# EAGLE design left (EAGLE 7.6.0)
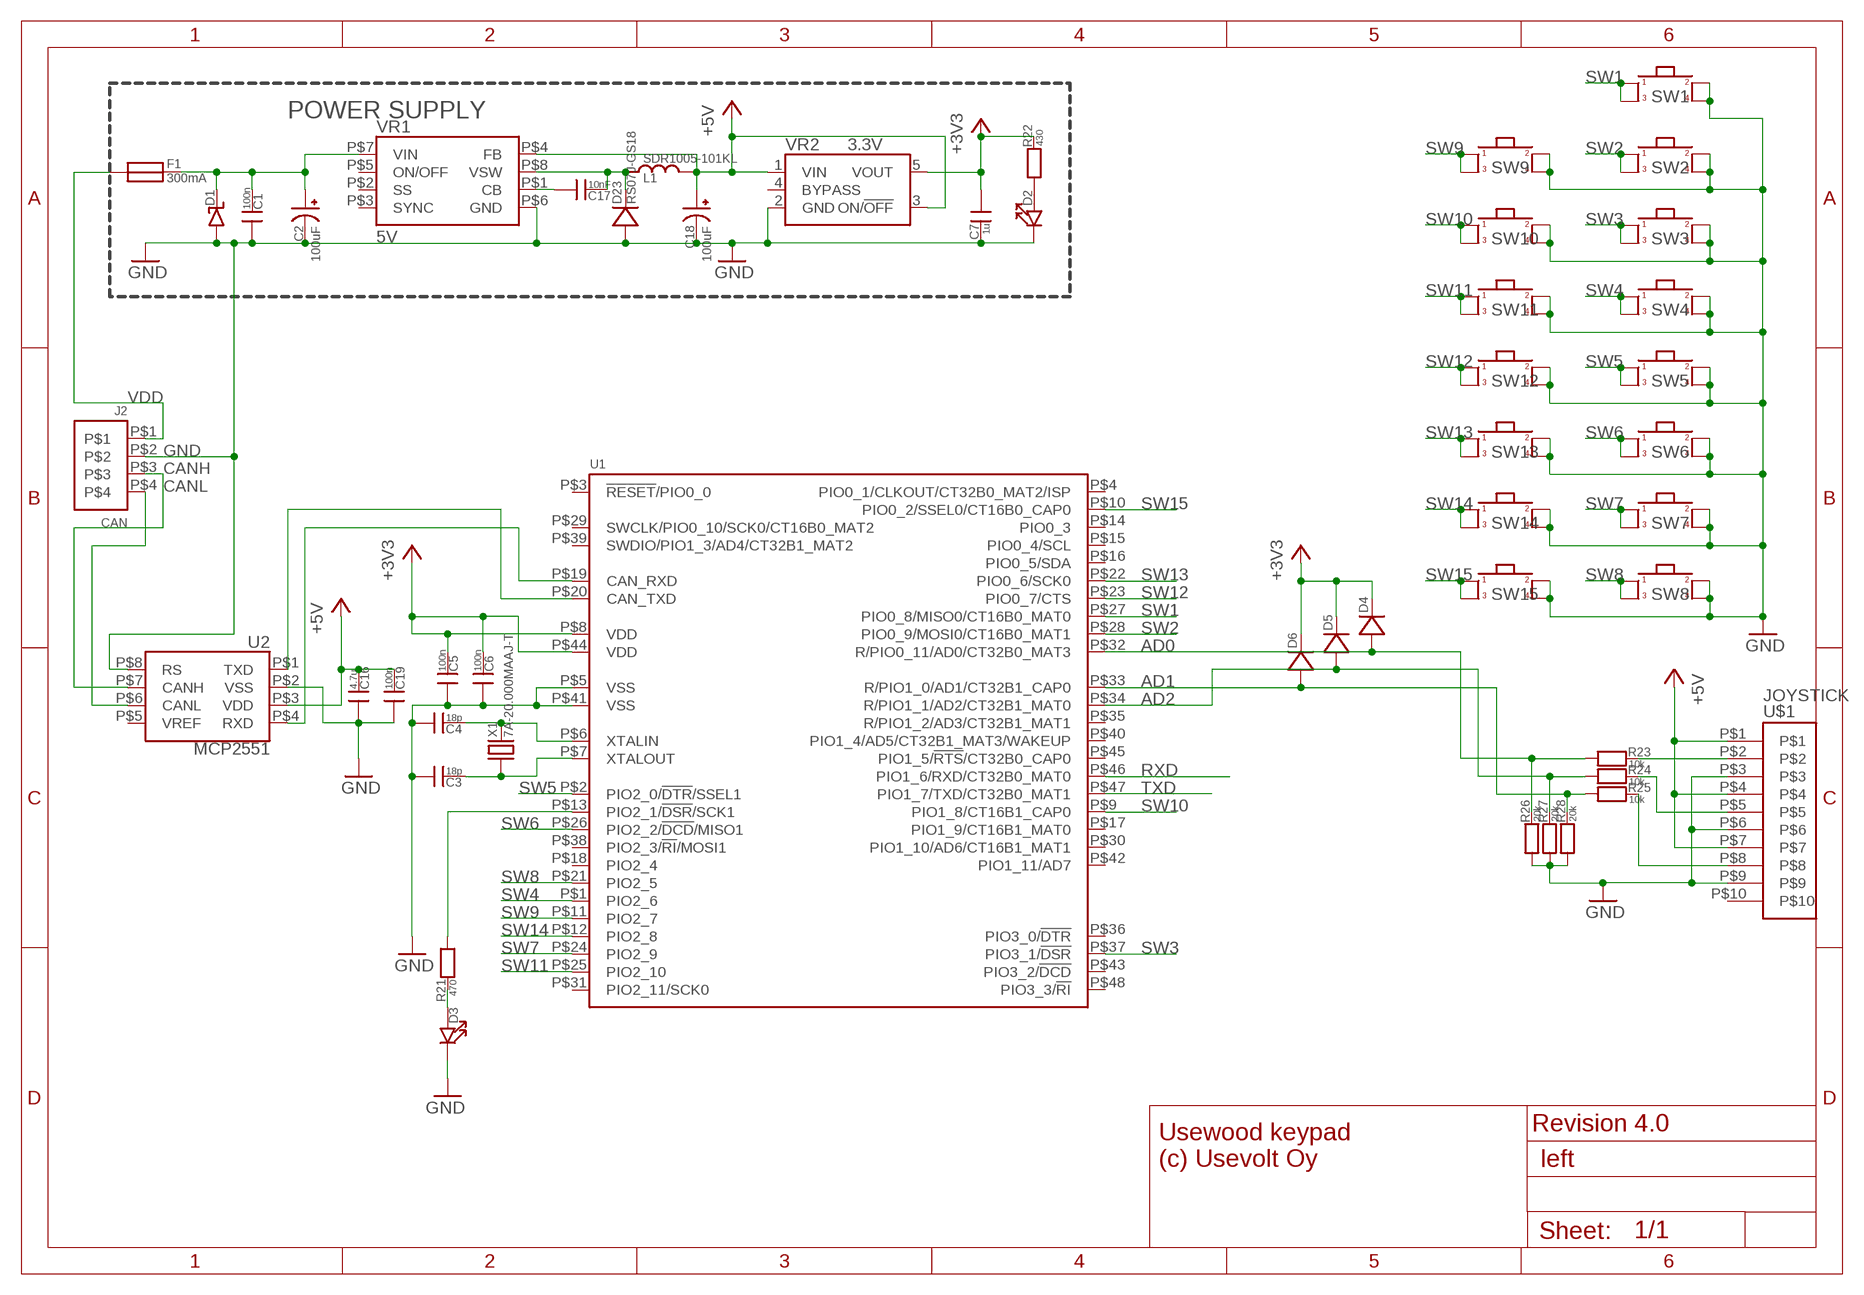
[diagram p0: schematic, sheet 1]

## Parts
C1  100n  CAP_0603  [0603_SILKSCREEN]
C2  100uF  CAP_EEE-FK1H470P  [CAP_POL_8.3X8.3MM]
C3  18p  CAP_0603  [0603_SILKSCREEN]
C4  18p  CAP_0603  [0603_SILKSCREEN]
C5  100n  CAP_0603  [0603_SILKSCREEN]
C6  100n  CAP_0603  [0603_SILKSCREEN]
C7  1u  CAP_0603  [0603_SILKSCREEN]
C16  4.7u  CAP_0603  [0603_SILKSCREEN]
C17  10nF  CAP_0603  [0603_SILKSCREEN]
C18  100uF  CAP_EEE-FK1H470P  [CAP_POL_8.3X8.3MM]
C19  100n  CAP_0603  [0603_SILKSCREEN]
D1  DIODE_TVS_SMBJ33A-TRDO-214AA  [DO-214AA]
D2  LED_0603  [0603_SILKSCREEN]
D3  LED_0603  [0603_SILKSCREEN]
D4  DIODEDO219AB  [DO219AB]
D5  DIODEDO219AB  [DO219AB]
D6  DIODEDO219AB  [DO219AB]
D23  RS07J-GS18  DIODEDO219AB  [DO219AB]
F1  300mA  FUSE_MC36204_100MA  [FUSE_100MA]
J2  CAN  MOLEX_MICRO-FIT_4WAY_SMD  [MOLEX_MICRO_FIT_4WAY_SMD]
L1  SDR1005-101KL  INDUCTORBOURNS_10X13X5MM  [INDUCTOR_BOURNS_10X13X5MM]
R21  470  RES_0603  [0603_SILKSCREEN]
R22  430  RES_0603  [0603_SILKSCREEN]
R23  10k  RES_0603  [0603_SILKSCREEN]
R24  10k  RES_0603  [0603_SILKSCREEN]
R25  10k  RES_0603  [0603_SILKSCREEN]
R26  20k  RES_0603  [0603_SILKSCREEN]
R27  20k  RES_0603  [0603_SILKSCREEN]
R28  20k  RES_0603  [0603_SILKSCREEN]
SW1  SWITCH_KSC421J-70SH-LFS  [SWITCH_KSC421J-70SH-LFS]
SW2  SWITCH_KSC421J-70SH-LFS  [SWITCH_KSC421J-70SH-LFS]
SW3  SWITCH_KSC421J-70SH-LFS  [SWITCH_KSC421J-70SH-LFS]
SW4  SWITCH_KSC421J-70SH-LFS  [SWITCH_KSC421J-70SH-LFS]
SW5  SWITCH_KSC421J-70SH-LFS  [SWITCH_KSC421J-70SH-LFS]
SW6  SWITCH_KSC421J-70SH-LFS  [SWITCH_KSC421J-70SH-LFS]
SW7  SWITCH_KSC421J-70SH-LFS  [SWITCH_KSC421J-70SH-LFS]
SW8  SWITCH_KSC421J-70SH-LFS  [SWITCH_KSC421J-70SH-LFS]
SW9  SWITCH_KSC421J-70SH-LFS  [SWITCH_KSC421J-70SH-LFS]
SW10  SWITCH_KSC421J-70SH-LFS  [SWITCH_KSC421J-70SH-LFS]
SW11  SWITCH_KSC421J-70SH-LFS  [SWITCH_KSC421J-70SH-LFS]
SW12  SWITCH_KSC421J-70SH-LFS  [SWITCH_KSC421J-70SH-LFS]
SW13  SWITCH_KSC421J-70SH-LFS  [SWITCH_KSC421J-70SH-LFS]
SW14  SWITCH_KSC421J-70SH-LFS  [SWITCH_KSC421J-70SH-LFS]
SW15  SWITCH_KSC421J-70SH-LFS  [SWITCH_KSC421J-70SH-LFS]
U1  LPC11C14_QFP48  [QFP48]
U2  MCP2551  MCP2551_SOIC8  [SOIC8]
U$1  JOYSTICK  MOLEX_MICRO-FIT_10WAY_V  [MOLEX_MICRO-FIT_10WAY_V]
VR1  5V  LM2671SOIC8  [SOIC8]
VR2  3.3V  REG_LP2985_SOP5  [SOP5]
X1  7A-20.000MAAJ-T  XTAL_7A-12.000MAAJ-T  [XTAL_SMD_5X3.2]

## Nets
+3V3: C5.1 C6.1 C7.0 D4.P$2(N) D5.P$2(N) D6.P$2(N) R22.1 U1.P$8(VDD) U1.P$44(VDD) VR2.5(VOUT)
+5V: C16.1 C18.P$2(+) C19.1 L1.P$2 U2.P$3(VDD) U$1.P$1 U$1.P$4 U$1.P$7 VR1.P$4(FB) VR2.1(VIN) VR2.3(ON/!OFF)
AD0: D4.P$1(P) R23.0 R26.1 U1.P$32(R/PIO0_11/AD0/CT32B0_MAT3)
AD1: D6.P$1(P) R25.0 R28.1 U1.P$33(R/PIO1_0/AD1/CT32B1_CAP0)
AD2: D5.P$1(P) R24.0 R27.1 U1.P$34(R/PIO1_1/AD2/CT32B1_MAT0)
CANH: J2.P$3 U2.P$7(CANH)
CANL: J2.P$4 U2.P$6(CANL)
GND: C1.0 C2.P$1(-) C3.0 C4.0 C5.0 C6.0 C7.1 C16.0 C18.P$1(-) C19.0 D1.P$1(P) D2.1 D3.1 D23.P$1(P) J2.P$2 R26.0 R27.0 R28.0 SW1.P$3 SW1.P$4 SW2.P$3 SW2.P$4 SW3.P$3 SW3.P$4 SW4.P$3 SW4.P$4 SW5.P$3 SW5.P$4 SW6.P$3 SW6.P$4 SW7.P$3 SW7.P$4 SW8.P$3 SW8.P$4 SW9.P$3 SW9.P$4 SW10.P$3 SW10.P$4 SW11.P$3 SW11.P$4 SW12.P$3 SW12.P$4 SW13.P$3 SW13.P$4 SW14.P$3 SW14.P$4 SW15.P$3 SW15.P$4 U1.P$5(VSS) U1.P$41(VSS) U2.P$2(VSS) U2.P$8(RS) U$1.P$3 U$1.P$6 U$1.P$9 VR1.P$6(GND) VR2.2(GND)
LED3: D3.0 R21.1
N$2: R21.0 U1.P$13(PIO2_1/!DSR!/SCK1)
N$3: D2.0 R22.0
N$4: C1.1 C2.P$2(+) D1.P$2(N) F1.P$2 VR1.P$7(VIN)
N$6: U1.P$20(CAN_TXD) U2.P$1(TXD)
N$11: C17.1 D23.P$2(N) L1.P$1 VR1.P$8(VSW)
N$20: U1.P$19(CAN_RXD) U2.P$4(RXD)
N$32: C17.0 VR1.P$1(CB)
RXD: U1.P$46(PIO1_6/RXD/CT32B0_MAT0)
SW1: SW1.P$1 SW1.P$2 U1.P$27(PIO0_8/MISO0/CT16B0_MAT0)
SW2: SW2.P$1 SW2.P$2 U1.P$28(PIO0_9/MOSI0/CT16B0_MAT1)
SW3: SW3.P$1 SW3.P$2 U1.P$37(PIO3_1/!DSR)
SW4: SW4.P$1 SW4.P$2 U1.P$1(PIO2_6)
SW5: SW5.P$1 SW5.P$2 U1.P$2(PIO2_0/!DTR!/SSEL1)
SW6: SW6.P$1 SW6.P$2 U1.P$26(PIO2_2/!DCD!/MISO1)
SW7: SW7.P$1 SW7.P$2 U1.P$24(PIO2_9)
SW8: SW8.P$1 SW8.P$2 U1.P$21(PIO2_5)
SW9: SW9.P$1 SW9.P$2 U1.P$11(PIO2_7)
SW10: SW10.P$1 SW10.P$2 U1.P$9(PIO1_8/CT16B1_CAP0)
SW11: SW11.P$1 SW11.P$2 U1.P$25(PIO2_10)
SW12: SW12.P$1 SW12.P$2 U1.P$23(PIO0_7/CTS)
SW13: SW13.P$1 SW13.P$2 U1.P$22(PIO0_6/SCK0)
SW14: SW14.P$1 SW14.P$2 U1.P$12(PIO2_8)
SW15: SW15.P$1 SW15.P$2 U1.P$10(PIO0_2/SSEL0/CT16B0_CAP0)
TXD: U1.P$47(PIO1_7/TXD/CT32B0_MAT1)
VDD: F1.P$1 J2.P$1
XJOY: R23.1 U$1.P$2
XTALIN: C4.1 U1.P$6(XTALIN) X1.P$2
XTALOUT: C3.1 U1.P$7(XTALOUT) X1.P$1
YJOY: R24.1 U$1.P$5
ZJOY: R25.1 U$1.P$8
Unconnected: U1.P$3(!RESET!/PIO0_0) U1.P$4(PIO0_1/CLKOUT/CT32B0_MAT2/ISP) U1.P$14(PIO0_3) U1.P$15(PIO0_4/SCL) U1.P$16(PIO0_5/SDA) U1.P$17(PIO1_9/CT16B1_MAT0) U1.P$18(PIO2_4) U1.P$29(SWCLK/PIO0_10/SCK0/CT16B0_MAT2) U1.P$30(PIO1_10/AD6/CT16B1_MAT1) U1.P$31(PIO2_11/SCK0) U1.P$35(R/PIO1_2/AD3/CT32B1_MAT1) U1.P$36(PIO3_0/!DTR) U1.P$38(PIO2_3/!RI!/MOSI1) U1.P$39(SWDIO/PIO1_3/AD4/CT32B1_MAT2) U1.P$40(PIO1_4/AD5/CT32B1_MAT3/WAKEUP) U1.P$42(PIO1_11/AD7) U1.P$43(PIO3_2/!DCD) U1.P$45(PIO1_5/!RTS!/CT32B0_CAP0) U1.P$48(PIO3_3/!RI) U2.P$5(VREF) U$1.P$10 VR1.P$2(SS) VR1.P$3(SYNC) VR1.P$5(ON/OFF) VR2.4(BYPASS)

## Notes on the sheet
- POWER SUPPLY
- Revision 4.0
- Usewood keypad
  (c) Usevolt Oy

## Library data of the parts
C1 C3-C7 C16 C17 C19 = usevolt:CAP; SMD_SIZE: 0603 (1608 metric)
C2 C18 = usevolt:CAP_EEE-FK1H470P: Digi-Key Part Number PCE3815CT-ND Price Break Unit Price Extended Price 1 0,82000 0,82 10 0,69000 6,90 25 0,56600 14,15 50 0,49400 24,70 100 0,43230 43,23 250 0,33960 84,90 500 0,30874 154,37 Quantity Available Digi-Key Stock: 70 314 Can ship immediately Manufacturer Panasonic Electronic Components Manufacturer Standard Lead Time 20 Weeks Manufacturer Part Number EEE-FK1H470P Description CAP ALUM 47UF 20% 50V SMD Lead Free Status / RoHS Status Lead free / RoHS Compliant Moisture Sensitivity Level (MSL) 1 (Unlimited; DIGIKEY_ID: PCE3815CT-ND; MANUFACTURER_ID: EEE-FK1H470P
D1 = usevolt:DIODE_TVS_SMBJ33A-TR: http://www.farnell.com/datasheets/1761316.pdf The Transil SMBJ series from STMicroelectronics are transient voltage suppressing diodes. These diodes are used to protect sensitive equipment against electrostatic discharges and electrical over stress. Transil SMBJ series are generally used against surges below 600W (10/1000 µs). Planar technology makes these devices suitable for high end equipment and SMPS where low leakage current and high junction temperature are required. These devices are packaged in SMB footprint in accordance with IPC 7531 standard. High reliability and stability Peak pulse power of 600W at 10/1000µs and 4KW at 8/20µs Standoff voltage range from 5V to 188V Available in unidirectional and bidirectional types Operating temperature range -55°C to 150°C High power capability of 515W Compliant IEC 61000-4-2 level 4, IEC 61000-4-5, UL 94, EIA STD RS-481 and IEC 60286-3 standards Meets MIL STD 883G, MIL-STD-750 standards; FARNELL_ID: 9886257; MANUFACTURER_ID: SMBJ33A-TR
D2 D3 = usevolt:LED; SMD_SIZE: 0603 (1608 metric)
D4-D6 D23 = usevolt:DIODE
F1 = usevolt:FUSE_MC36204_100MA: Carrying Current Max: 10A Holding Current: 100mA Initial Resistance Max: 15ohm Operating Temperature Max: 85°C Operating Voltage: 60VDC PTC Fuse Case Style: SMD Product Range: MC36 Series SVHC: No SVHC (15-Jun-2015) Tripping Current: 300mA; FARNELL_ID: 1861161; MANUFACTURER_ID: MC36204
J2 = usevolt:MOLEX_MICRO-FIT_4WAY: http://www.farnell.com/datasheets/2016912.pdf MOLEX 43045-0418 Wire-To-Board Connector, Vertical, Micro-Fit 3.0 43045 Series, Surface Mount, Header, 4, 3 mm ★★★★★ ★★★★★ Lisää suosikkeihin Huomasitko virheen? Tulosta sivu MOLEX 43045-0418 Suurenna napsauttamalla Kuva on vain kuvaavaa tarkoitusta varten. Lue tuotekuvaus tarkempia tietoja varten. MOLEX Valmistaja MOLEX Tilauskoodi: 9961429 Valmistajan osanumero 43045-0418 Pakkaus:: Yksittäispakkaus Technical Data Sheet (30.17KB) EN Inne rodzaje opakowania Kela 200/kela 2426308 Tarkista saatavuus ja hinta Tuotteen yleiskatsaus Fully polarized housings Positive latching Locking tang on terminal Back to top Tuotetiedot, asiakirjat ja muuta Product Range Micro-Fit 3.0 43045 Series No. of Contacts 4 Pitch Spacing 3mm Contact Termination Type Surface Mount Gender Header; FARNELL_ID: 9961429; MANUFACTURER_ID: 43045-0418
L1 = usevolt:INDUCTOR
R21-R28 = usevolt:RES; SMD_SIZE: 0603 (1608 metric)
SW1-SW15 = usevolt:SWITCH_KSC421J-70SH-LFS; DIGIKEY_ID: 401-1780-1-ND; MANUFACTURER_ID: KSC421J 70SH LFS
U1 = usevolt:LPC11C14: http://www.farnell.com/datasheets/1708214.pdf NXP LPC11C14FBD48/301 32 Bit Microcontroller, Low Power, ARM Cortex-M0, 50 MHz, 32 KB, 8 KB, 48, LQFP Lisää suosikkeihin Huomasitko virheen? Tulosta sivu NXP LPC11C14FBD48/301 Suurenna napsauttamalla Kuva on vain kuvaavaa tarkoitusta varten. Lue tuotekuvaus tarkempia tietoja varten. NXP Valmistaja NXP Tilauskoodi: 1812185 Valmistajan osanumero LPC11C14FBD48/301 Technical Data Sheet (322.12KB) EN Tuotteen yleiskatsaus The LPC11C14FBD48/301 is a 32kB flash 8kB SRAM Cortex-M0 Microcontroller Unit designed for 8/16-bit microcontroller applications, offering performance, low power, simple instruction set and memory addressing together with reduced code size compared to existing 8/16-bit architectures. The peripheral complement of the microcontroller with 32kB of flash memory, 8kB of data memory, one fast-mode Plus I²C-bus interface and one RS-485/EIA-485 UART, two SPI interfaces with SSP features, four general purpose counter/timers, a 10-bit ADC and 40 general purpose I/O pins. ARM Cortex-M0 built-in nested vectored interrupt controller Serial wire debug System tick timer High current output driver on one pin Programmable watchdog timer UART with fractional baud rate generation Integrated PMU to minimize power consumption Sovellukset Metering; Industrial; Sensing & Instrumentation Back to top Tuotetiedot, asiakirjat ja muuta Architecture: ARM Cortex-M0 CPU Speed: 50MHz Embedded Interface Type: CAN, I2C, SPI, UART MCU Case Style: LQFP MSL: - No. of I/O's: 40 No. of Pins: 48 Packaging: Each Program Memory Size: 32KB RAM Memory Size: 8KB SVHC: No SVHC (15-Jun-2015) Supply Voltage Max: 3.6V Supply Voltage Min: 1.8V; FARNELL_ID: 1812185; MANUFACTURER_ID: LPC11C14FBD48/301; MOUSER_ID: 771-LPC11C14FD48301
U2 = usevolt:MCP2551: Microchip High-Speed CAN Transceiver Supports 1 Mb/s operation • Implements ISO-11898 standard physical layer requirements • Suitable for 12V and 24V systems • Externally-controlled slope for reduced RFI emissions • Detection of ground fault (permanent dominant) on TXD input • Power-on reset and voltage brown-out protection • An unpowered node or brown-out event will not disturb the CAN bus • Low current standby operation • Protection against damage due to short-circuit conditions (positive or negative battery voltage) • Protection against high-voltage transients • Automatic thermal shutdown protection • Up to 112 nodes can be connected • High noise immunity due to differential bus implementation • Temperature ranges: - Industrial (I): -40°C to +85°C - Extended (E): -40°C to +125°C http://www.digikey.com/product-detail/en/MCP2551T-E%2FSN/MCP2551T-E%2FSNCT-ND/4307904 http://ww1.microchip.com/downloads/en/DeviceDoc/21667f.pdf http://www.farnell.com/datasheets/657417.pdf http://fi.farnell.com/microchip/mcp2551-i-sn/ic-can-transceiver-hi-speed-smd/dp/9758569
U$1 = usevolt:MOLEX_MICRO-FIT_10WAY_V; MANUFACTURER_ID: 43045-1027; MOUSER_ID: 538-43045-1027
VR1 = usevolt:LM2671: TEXAS INSTRUMENTS LM2671MX-5.0/NOPB IC, STEP-DOWN REGULATOR, SOIC-8 http://www.farnell.com/datasheets/1874686.pdf
VR2 = usevolt:REG_LP2985: http://www.farnell.com/datasheets/1965480.pdf TEXAS INSTRUMENTS LP2985-33DBVTE4 Fixed LDO Voltage Regulator, 2.2V to 16V, 280mV Dropout, 3.3Vout, 150mAout, SOT-23-5 Lisää suosikkeihin Huomasitko virheen? Tulosta sivu TEXAS INSTRUMENTS LP2985-33DBVTE4 Suurenna napsauttamalla Kuva on vain kuvaavaa tarkoitusta varten. Lue tuotekuvaus tarkempia tietoja varten. TEXAS INSTRUMENTS Valmistaja TEXAS INSTRUMENTS Tilauskoodi: 1053672 Valmistajan osanumero LP2985-33DBVTE4 Technical Data Sheet (1.24MB) EN Tuotteen yleiskatsaus The LP2985-33DBVTE4 is a 150mA 3.3V low quiescent current low noise fixed-output low-dropout regulator available in voltage of 3.3V, the family has an output tolerance of 1.5% for the non-A version and is capable of delivering 150mA continuous load current. Standard regulator features, such as over-current and over-temperature protection are included. 0.01µA Typical Shutdown current 30µVRMS Low noise with 10nF bypass capacitor Stable with low-ESR capacitors, including ceramic Over-current and thermal protection High peak-current capability ESD protection exceeds JESD 22 Green product and no Sb/Br Sovellukset Power Management; Consumer Electronics; Portable Devices This device has limited built-in ESD protection, leads should be shorted together or the device placed in conductive foam during storage or handling to prevent electrostatic damage to the MOS gates. Back to top Tuotetiedot, asiakirjat ja muuta Dropout Voltage Vdo: 280mV Input Voltage Max: 16V Input Voltage Min: 2.2V LDO Regulator Case Style: SOT-23 MSL: MSL 1 - Unlimited No. of Pins: 5 Operating Temperature Max: 125°C Operating Temperature Min: -40°C Output Current: 150mA Output Voltage Nom.: 3.3V Packaging: Cut Tape; FARNELL_ID: 1053672; INPUT_VOLTAGE_MAX: 16 V; MANUFACTURER_ID: LP2985-33DBVTE4; OUTPUT_CURRENT: 150 mA; OUTPU_VOLTAGE: 3.3 V
X1 = usevolt:XTAL_7A-12.000MAAJ-T: http://www.farnell.com/datasheets/1041607.pdf TXC 7A-12.000MAAJ-T XTAL, 12.000MHZ, 18PF, SMD, 5.0X3.2 ★★★★★ ★★★★★ Lisää suosikkeihin Huomasitko virheen? Tulosta sivu TXC 7A-12.000MAAJ-T Suurenna napsauttamalla Kuva on vain kuvaavaa tarkoitusta varten. Lue tuotekuvaus tarkempia tietoja varten. TXC Valmistaja TXC Tilauskoodi: 1841940RL Valmistajan osanumero 7A-12.000MAAJ-T Technical Data Sheet (503.86KB) EN Uudelleenkelauspalvelut Tuotteen yleiskatsaus The 7A-12.000MAAJ-T is a 5 x 3.2mm SMD Glass Sealed Quartz Crystal. It is designed for automatic mounting and reflow soldering. 2 Pads SMD Glass Sealed Crystal Unit High Reliable Environmental Performance Tight Tolerance and Stability Reasonable Cost and Good Delivery Performance Contains Pb in Sealing Glass Exempted by RoHS Directive Ageing ±3ppm Per Year Max Sovellukset Portable Devices; Computers & Computer Peripherals Back to top Tuotetiedot, asiakirjat ja muuta Product Range 7A Series Frequency Nom 12MHz Frequency Stability + / - 30ppm Frequency Tolerance + / - 30ppm Crystal Case SMD, 5mm x 3.2mm Load Capacitance 18pF Operating Temperature Min -40°C Operating Temperature Max 85°C SVHC; FARNELL_ID: 1841940RL; MANUFACTURER_ID: 7A-12.000MAAJ-T

## Board
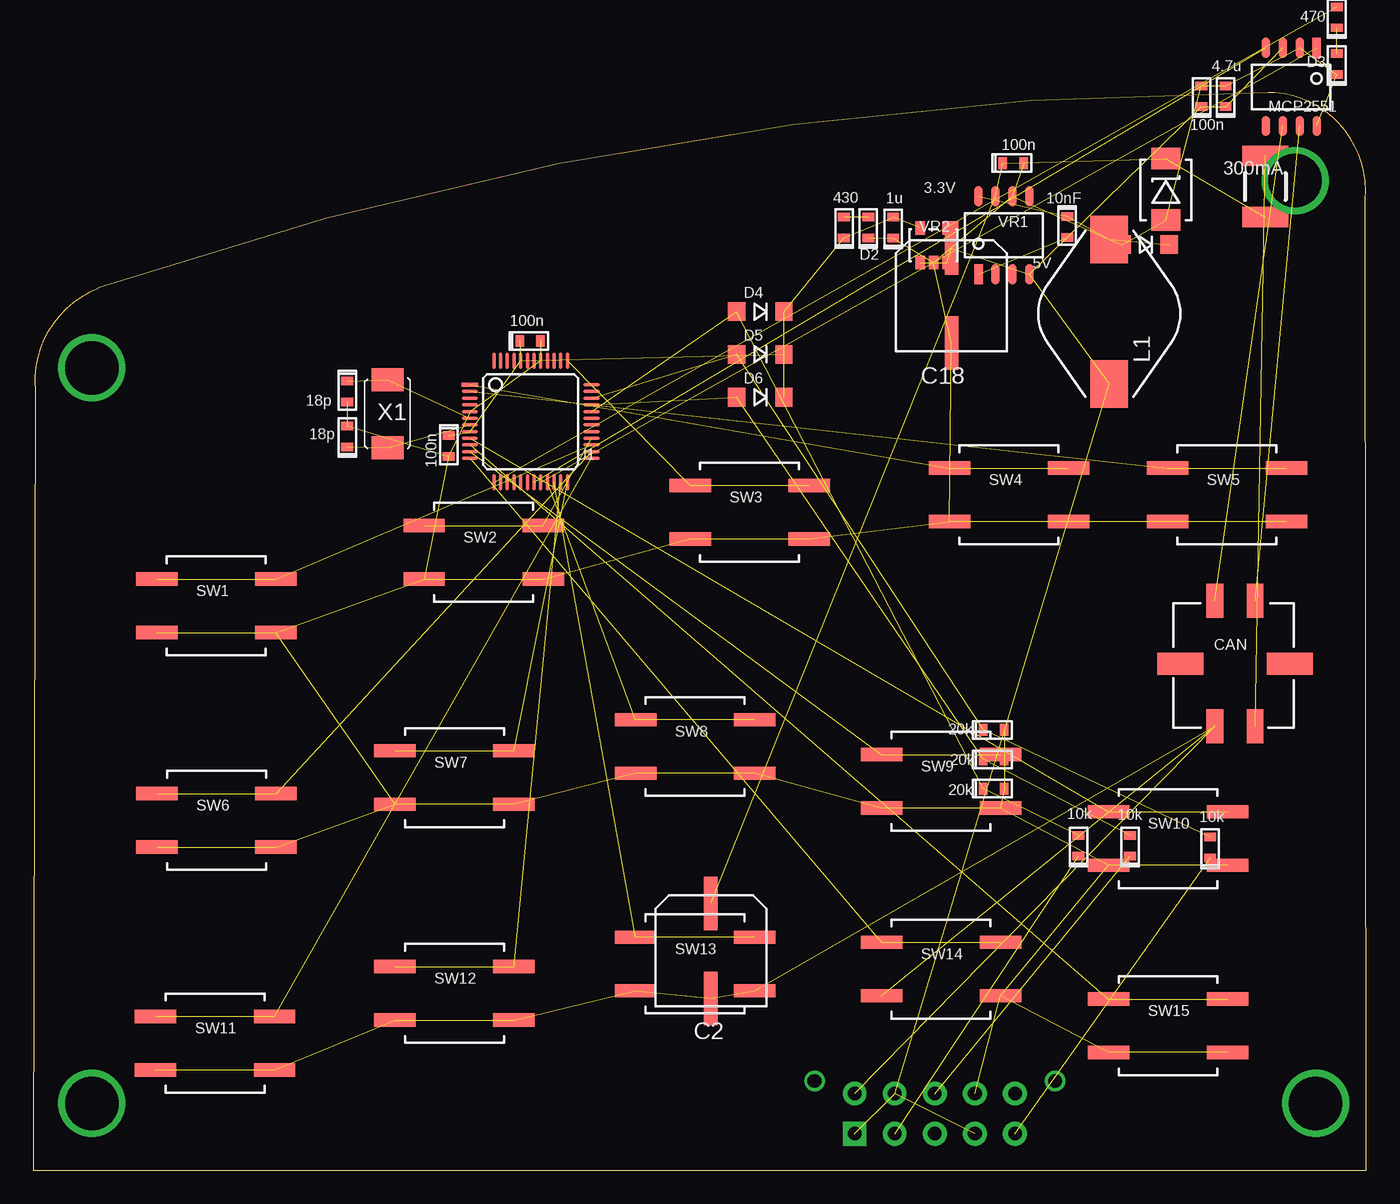
[diagram p1: board, top side]
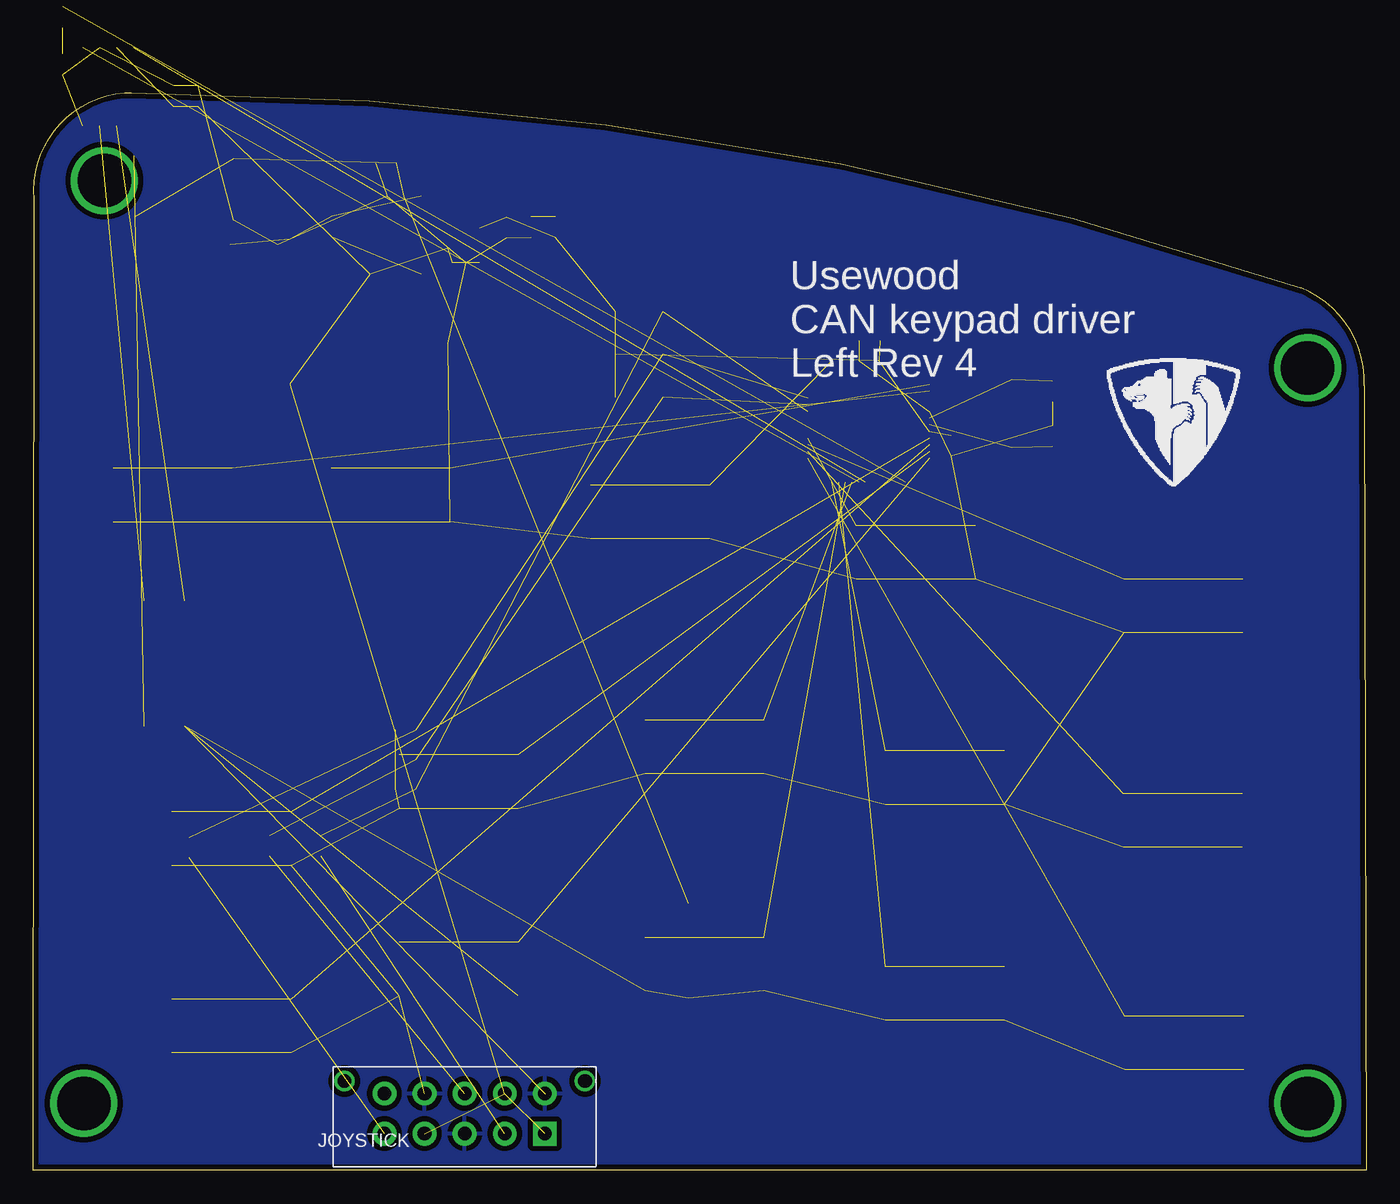
[diagram p2: board, bottom side, seen from below]

Size 99.68 x 80.58 mm. Coordinates in mm from the lower left corner, seen from the top.
Outline: 99.68,0 99.63,72.6 arc90 92.87,80.58 92.37,80.58 arc19 4.89,65.97 arc71 0.14,58.64 0,0 99.68,0
Copper layers (1*16): Top 0.035mm / dielectric 1.5mm / Bottom 0.035mm
Design rules "SeeedStudio_2layer_DRU_no_angle_20140221 *": minimum track width 6mil, minimum drill 8mil, track to track 6mil, track to pad 6mil, pad to pad 6mil, via to via 6mil, smd to smd 0mil, copper to edge 10mil, drill to drill 10mil, minimum pad ring 10mil, minimum via ring 6mil, stop-mask expansion 2mil, vias tented up to drill 100mil, thermal gap 16mil

### Footprints (pad centres in the part's own frame; a part is rotated, then mirrored left to right if it is on the bottom)
0603_SILKSCREEN = smd 0.635 x 0.889: 0 -0.781,0; 1 0.781,0
CAP_POL_8.3X8.3MM = smd 1 x 4: P$1 0,3.55; P$2 0,-3.55
DO-214AA = smd 1.62 x 2.18: P$1 -2.3,0; P$2 2.3,0
DO219AB = smd 1.3 x 1.4: P$1 -1.768,0; P$2 1.768,0
FUSE_100MA = smd 1.5 x 3.41: P$1 -2.286,0; P$2 2.286,0
MOLEX_MICRO_FIT_4WAY_SMD = smd 1.27 x 2.54: P$1 1.55,-4.65; P$2 -1.45,-4.65; P$3 1.55,4.75; P$4 -1.45,4.75 | smd 3.43 x 1.65: P$5 4.15,0.05; P$6 -4.05,0.05
INDUCTOR_BOURNS_10X13X5MM = smd 3.556 x 2.8: P$1 -5.404,0; P$2 5.404,0
SWITCH_KSC421J-70SH-LFS = smd 3.1 x 1: P$1 -4.45,2; P$2 4.45,2; P$3 -4.45,-2; P$4 4.45,-2
QFP48 = smd 1.246 x 0.28: P$1 -4.548,2.75; P$2 -4.548,2.25; P$3 -4.548,1.75; P$4 -4.548,1.25; P$5 -4.548,0.75; P$6 -4.548,0.25; P$7 -4.548,-0.25; P$8 -4.548,-0.75; P$9 -4.548,-1.25; P$10 -4.548,-1.75; P$11 -4.548,-2.25; P$12 -4.548,-2.75; P$25 4.548,-2.75; P$26 4.548,-2.25; P$27 4.548,-1.75; P$28 4.548,-1.25; P$29 4.548,-0.75; P$30 4.548,-0.25; P$31 4.548,0.25; P$32 4.548,0.75; P$33 4.548,1.25; P$34 4.548,1.75; P$35 4.548,2.25; P$36 4.548,2.75 | smd 0.28 x 1.246: P$13 -2.75,-4.548; P$14 -2.25,-4.548; P$15 -1.75,-4.548; P$16 -1.25,-4.548; P$17 -0.75,-4.548; P$18 -0.25,-4.548; P$19 0.25,-4.548; P$20 0.75,-4.548; P$21 1.25,-4.548; P$22 1.75,-4.548; P$23 2.25,-4.548; P$24 2.75,-4.548; P$37 2.75,4.548; P$38 2.25,4.548; P$39 1.75,4.548; P$40 1.25,4.548; P$41 0.75,4.548; P$42 0.25,4.548; P$43 -0.25,4.548; P$44 -0.75,4.548; P$45 -1.25,4.548; P$46 -1.75,4.548; P$47 -2.25,4.548; P$48 -2.75,4.548
SOIC8 = smd 1.524 x 0.635: P$1 -2.921,1.905; P$2 -2.921,0.635; P$3 -2.921,-0.635; P$4 -2.921,-1.905; P$5 2.921,-1.905; P$6 2.921,-0.635; P$7 2.921,0.635; P$8 2.921,1.905
MOLEX_MICRO-FIT_10WAY_V = drill 1.02 pad 1.778 square: P$1 5.994,0 | drill 1.02 pad 1.778: P$2 2.997,0; P$3 0,0; P$4 -2.997,0; P$5 -5.994,0; P$6 5.994,2.997; P$7 2.997,2.997; P$8 0,2.997; P$9 -2.997,2.997; P$10 -5.994,2.997 | drill 1.02: P$11 9,3.94; P$12 -9,3.94
SOP5 = smd 0.7 x 1: 1 -1,-1.3; 2 0,-1.3; 3 1,-1.3; 4 1,1.3; 5 -1,1.3
XTAL_SMD_5X3.2 = smd 1.7 x 2.4: P$1 -2.54,0; P$2 2.54,0

### Placement (x,y rotation side)
C1  73.29,75.3 180 top
C2  50.67,16.4 180 top
C3  23.48,54.87 270 top
C4  23.48,58.23 90 top
C5  31.06,54.15 90 top
C6  37.15,62 180 top
C7  64.31,70.48 270 top
C16  89.17,80.3 270 top
C17  77.33,70.54 90 top
C18  68.67,65.4 180 top
C19  87.37,80.3 270 top
D1  84.7,73.34 90 top
D2  62.45,70.5 270 top
D3  97.49,82.71 270 top
D4  54.37,64.2 0 top
D5  54.37,61 0 top
D6  54.37,57.8 0 top
D23  83.19,69.21 0 top
F1  92.15,73.56 270 top
J2  89.83,37.83 0 top
L1  80.47,64.2 270 top
R21  97.49,86.21 270 top  (outside the outline)
R22  60.64,70.5 270 top
R23  78.17,24.26 270 top
R24  88.02,24.13 270 top
R25  82.02,24.26 270 top
R26  71.83,28.53 180 top
R27  71.83,32.93 180 top
R28  71.83,30.72 180 top
SW1  13.67,42.2 0 top
SW2  33.67,46.2 0 top
SW3  53.57,49.2 0 top
SW4  72.97,50.5 0 top
SW5  89.27,50.5 0 top
SW6  13.69,26.16 0 top
SW7  31.49,29.36 0 top
SW8  49.49,31.68 0 top
SW9  67.89,29.08 0 top
SW10  84.87,24.8 0 top
SW11  13.59,9.5 0 top
SW12  31.49,13.22 0 top
SW13  49.49,15.42 0 top
SW14  67.89,15.04 0 top
SW15  84.87,10.8 0 top
U1  37.19,55.98 0 top
U2  94.07,81 270 top
U$1  67.43,2.73 0 bottom
VR1  72.59,69.91 90 top
VR2  67.33,69.16 0 top
X1  26.49,56.56 90 top

### Tracks (layer width: path | path; a pad name or v marks a point on that pad's centre or on a via)
+3V3  (9 unrouted)
+5V  (10 unrouted)
AD0  (3 unrouted)
AD1  (3 unrouted)
AD2  (3 unrouted)
CANH  (1 unrouted)
CANL  (1 unrouted)
GND  (54 unrouted)
  pour Bottom (isolate 0.4, rank 6): 0,0 0,59.21 arc-16 0.18,60.48 arc-50 4.87,65.87 arc-8 5.64,66.15 arc4 9.14,67.27 arc-8 32.24,73.64 arc2 39.1,75.11 arc-4 47.85,76.79 arc-2 62.13,78.75 arc-5 83.34,80.29 arc-1 92.16,80.43 arc-91 99.58,73.01 99.65,0
  cutout Top (isolate 0.4, rank 6): 0,0 0,59.21 arc-16 0.18,60.48 arc-50 4.87,65.87 arc-8 5.64,66.15 arc4 9.14,67.27 arc-8 32.24,73.64 arc2 39.1,75.11 arc-4 47.85,76.79 arc-2 62.13,78.75 arc-5 83.34,80.29 arc-1 92.16,80.43 arc-91 99.58,73.01 99.65,0
LED3  (1 unrouted)
N$2  (1 unrouted)
N$3  (1 unrouted)
N$4  (4 unrouted)
N$6  (1 unrouted)
N$7  (via drill 4)
  other vias: 95.92,5
N$8  (via drill 4)
  other vias: 4.37,5
N$9  (via drill 4)
  other vias: 4.37,60
N$10  (via drill 4)
  other vias: 94.37,74
N$11  (3 unrouted)
N$20  (1 unrouted)
N$32  (1 unrouted)
SW1  (2 unrouted)
SW2  (2 unrouted)
SW3  (2 unrouted)
SW4  (2 unrouted)
SW5  (2 unrouted)
SW6  (2 unrouted)
SW7  (2 unrouted)
SW8  (2 unrouted)
SW9  (2 unrouted)
SW10  (2 unrouted)
SW11  (2 unrouted)
SW12  (2 unrouted)
SW13  (2 unrouted)
SW14  (2 unrouted)
SW15  (2 unrouted)
VDD  (1 unrouted)
XJOY  (1 unrouted)
XTALIN  (2 unrouted)
XTALOUT  (2 unrouted)
YJOY  (1 unrouted)
ZJOY  (1 unrouted)

### Text on the board
bPlace: Usewood / CAN keypad driver / Left Rev 4